# Altium project RK3328.PrjPcb (part 3 of 3)

## Sheet CPU_SDIO_UART_I2C_I2C.SchDoc
size A3; SheetNumber: 10; SheetTotal: 21
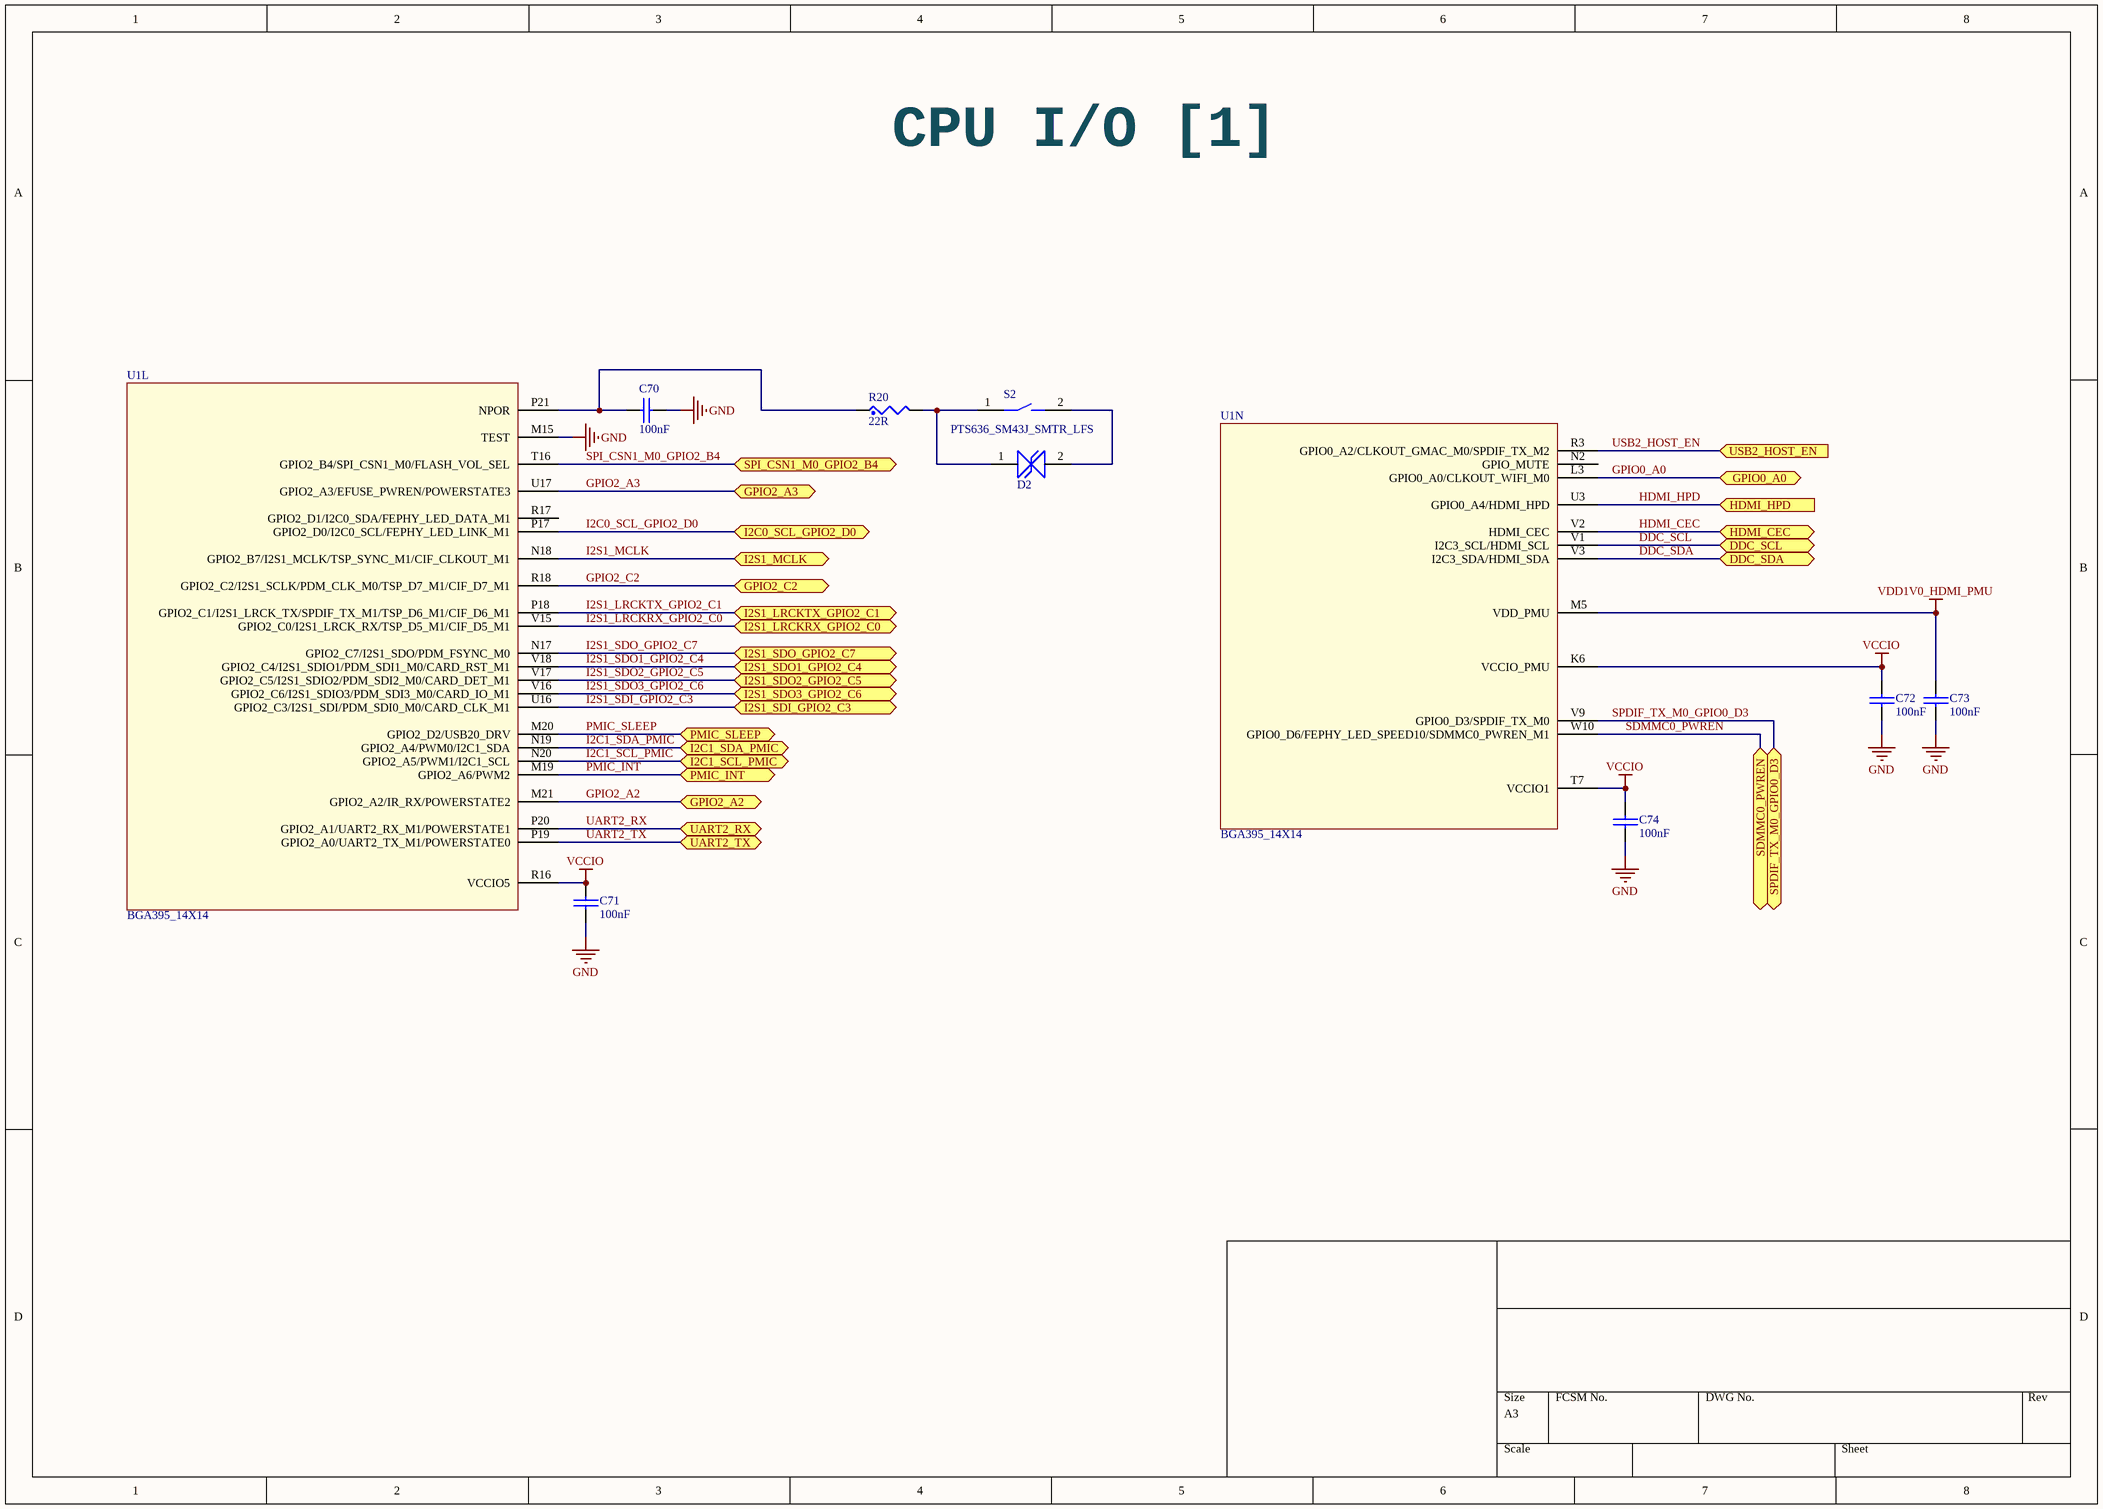
[diagram p18: CPU_SDIO_UART_I2C_I2C.SchDoc]

### Parts
C70  100nF  [0402_CC - C]
C71  100nF  [0402_CC - C]
C72  100nF  [0402_CC - C]
C73  100nF  [0402_CC - C]
C74  100nF  [0402_CC - C]
D2  TVS  [SODFL100X45-2N]  (value not drawn)
R20  22R  [0402_CR]
S2  PTS636_SM43J_SMTR_LFS  [PTS636_3.5_6_4.3]
U1  BGA395_14X14  [BGA395C65P21X21_1750X1750X117]  (parts L,N of 17)

### Ports
DDC_SCL (bidir), DDC_SDA (bidir), GPIO0_A0 (bidir), GPIO2_A2 (bidir), GPIO2_A3 (bidir), GPIO2_C2 (bidir), HDMI_CEC (bidir), HDMI_HPD (in), I2C0_SCL_GPIO2_D0 (bidir), I2C1_SCL_PMIC (bidir), I2C1_SDA_PMIC (bidir), I2S1_LRCKRX_GPIO2_C0 (bidir), I2S1_LRCKTX_GPIO2_C1 (bidir), I2S1_MCLK (bidir), I2S1_SDI_GPIO2_C3 (bidir), I2S1_SDO1_GPIO2_C4 (bidir), I2S1_SDO2_GPIO2_C5 (bidir), I2S1_SDO3_GPIO2_C6 (bidir), I2S1_SDO_GPIO2_C7 (bidir), PMIC_INT (bidir), PMIC_SLEEP (bidir), SDMMC0_PWREN (bidir), SPDIF_TX_M0_GPIO0_D3 (bidir), SPI_CSN1_M0_GPIO2_B4 (bidir), UART2_RX (bidir), UART2_TX (bidir), USB2_HOST_EN (in)

### Nets
GND: C70.2 C71.1 C72.1 C73.1 C74.1 U1.M15(TEST)
VCCIO: C71.2 C72.2 C74.2 U1.K6(VCCIO_PMU) U1.R16(VCCIO5) U1.T7(VCCIO1)
VDD1V0_HDMI_PMU: C73.2 U1.M5(VDD_PMU)
DDC_SCL: U1.V1(I2C3_SCL/HDMI_SCL) ; port DDC_SCL
DDC_SDA: U1.V3(I2C3_SDA/HDMI_SDA) ; port DDC_SDA
GPIO0_A0: U1.L3(GPIO0_A0/CLKOUT_WIFI_M0) ; port GPIO0_A0
GPIO2_A2: U1.M21(GPIO2_A2/IR_RX/POWERSTATE2) ; port GPIO2_A2
GPIO2_A3: U1.U17(GPIO2_A3/EFUSE_PWREN/POWERSTATE3) ; port GPIO2_A3
GPIO2_C2: U1.R18(GPIO2_C2/I2S1_SCLK/PDM_CLK_M0/TSP_D7_M1/CIF_D7_M1) ; port GPIO2_C2
HDMI_CEC: U1.V2(HDMI_CEC) ; port HDMI_CEC
HDMI_HPD: U1.U3(GPIO0_A4/HDMI_HPD) ; port HDMI_HPD
I2C0_SCL_GPIO2_D0: U1.P17(GPIO2_D0/I2C0_SCL/FEPHY_LED_LINK_M1) ; port I2C0_SCL_GPIO2_D0
I2C1_SCL_PMIC: U1.N20(GPIO2_A5/PWM1/I2C1_SCL) ; port I2C1_SCL_PMIC
I2C1_SDA_PMIC: U1.N19(GPIO2_A4/PWM0/I2C1_SDA) ; port I2C1_SDA_PMIC
I2S1_LRCKRX_GPIO2_C0: U1.V15(GPIO2_C0/I2S1_LRCK_RX/TSP_D5_M1/CIF_D5_M1) ; port I2S1_LRCKRX_GPIO2_C0
I2S1_LRCKTX_GPIO2_C1: U1.P18(GPIO2_C1/I2S1_LRCK_TX/SPDIF_TX_M1/TSP_D6_M1/CIF_D6_M1) ; port I2S1_LRCKTX_GPIO2_C1
I2S1_MCLK: U1.N18(GPIO2_B7/I2S1_MCLK/TSP_SYNC_M1/CIF_CLKOUT_M1) ; port I2S1_MCLK
I2S1_SDI_GPIO2_C3: U1.U16(GPIO2_C3/I2S1_SDI/PDM_SDI0_M0/CARD_CLK_M1) ; port I2S1_SDI_GPIO2_C3
I2S1_SDO1_GPIO2_C4: U1.V18(GPIO2_C4/I2S1_SDIO1/PDM_SDI1_M0/CARD_RST_M1) ; port I2S1_SDO1_GPIO2_C4
I2S1_SDO2_GPIO2_C5: U1.V17(GPIO2_C5/I2S1_SDIO2/PDM_SDI2_M0/CARD_DET_M1) ; port I2S1_SDO2_GPIO2_C5
I2S1_SDO3_GPIO2_C6: U1.V16(GPIO2_C6/I2S1_SDIO3/PDM_SDI3_M0/CARD_IO_M1) ; port I2S1_SDO3_GPIO2_C6
I2S1_SDO_GPIO2_C7: U1.N17(GPIO2_C7/I2S1_SDO/PDM_FSYNC_M0) ; port I2S1_SDO_GPIO2_C7
PMIC_INT: U1.M19(GPIO2_A6/PWM2) ; port PMIC_INT
PMIC_SLEEP: U1.M20(GPIO2_D2/USB20_DRV) ; port PMIC_SLEEP
SDMMC0_PWREN: U1.W10(GPIO0_D6/FEPHY_LED_SPEED10/SDMMC0_PWREN_M1) ; port SDMMC0_PWREN
SPDIF_TX_M0_GPIO0_D3: U1.V9(GPIO0_D3/SPDIF_TX_M0) ; port SPDIF_TX_M0_GPIO0_D3
SPI_CSN1_M0_GPIO2_B4: U1.T16(GPIO2_B4/SPI_CSN1_M0/FLASH_VOL_SEL) ; port SPI_CSN1_M0_GPIO2_B4
UART2_RX: U1.P20(GPIO2_A1/UART2_RX_M1/POWERSTATE1) ; port UART2_RX
UART2_TX: U1.P19(GPIO2_A0/UART2_TX_M1/POWERSTATE0) ; port UART2_TX
USB2_HOST_EN: U1.R3(GPIO0_A2/CLKOUT_GMAC_M0/SPDIF_TX_M2) ; port USB2_HOST_EN
NetC70_1: C70.1 R20.1 U1.P21(NPOR)
NetD2_1: D2.1 R20.2 S2.1
NetD2_2: D2.2 S2.2

Not connected (* = marked no-connect by the designer): U1 N2(GPIO_MUTE) R17(GPIO2_D1/I2C0_SDA/FEPHY_LED_DATA_M1)

### Notes on the sheet
- CPU I/O [1]

### Library data of the parts
C70-C74 = CAP_NP: CLASS: DISCRETE
D2 = ESD5451N: AZ5825-01F, Bi-directional TVS, Working Voltage = 5V, Transient protection IEC61000-4-2 : +-30KV,  By AAR; Mfr_Part_No: ESD5451N-2/TR; ComponentLink1Description: Supplier; ComponentLink1URL: https://lcsc.com/product-detail/TVS_Will-Semicon-ESD5451N-2-TR_C239604.html; LCSC Part #: C239604; Package/Case: =Footprint
R20 = RES: CLASS: DISCRETE
S2 = PTS636: Tactile Switches Tact 50mA 12VDC, 6.0x3.5, 4.3mm H, 180gf, J leads, No ground pin, Black Actuator; Mfr_Part_No: PTS636 SM43J SMTR LFS; Mouser No: 611-PTS636SM43JSMTRL
U1 = RK3328: By AAR

## Sheet CPU_AV.SchDoc
size A3; SheetNumber: 21; SheetTotal: 21
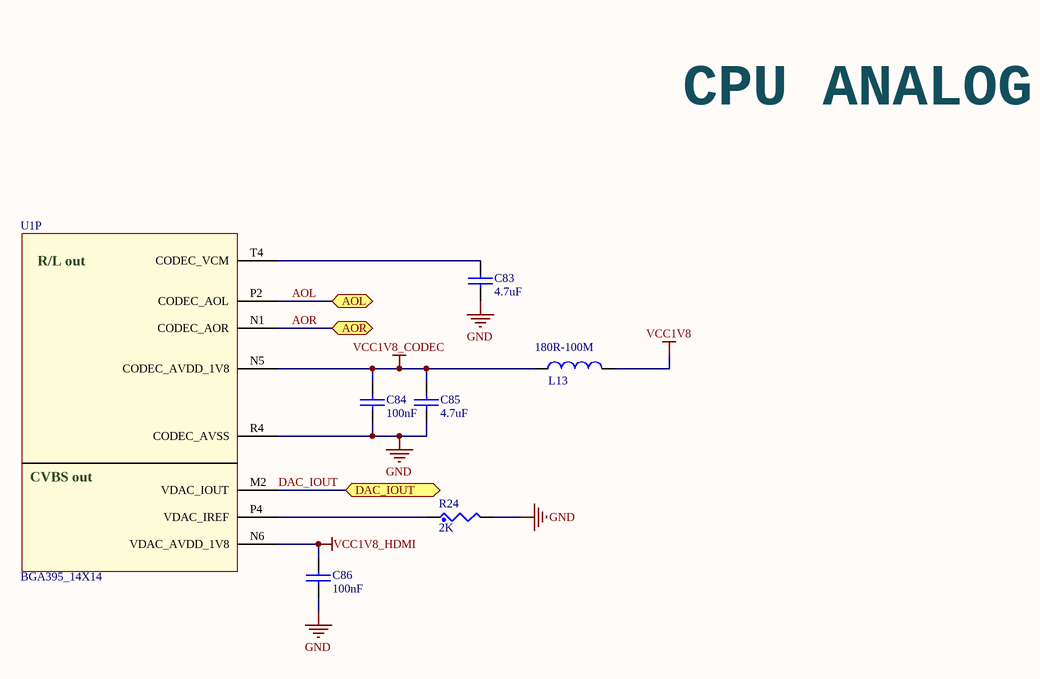
[diagram p19: CPU_AV.SchDoc]

### Parts
C83  4.7uF  [0402_CC - C]
C84  100nF  [0402_CC - C]
C85  4.7uF  [0402_CC - C]
C86  100nF  [0402_CC - C]
L13  180R-100M  [0603_C_Inductor]
R24  2K  [0402_CR]
U1  BGA395_14X14  [BGA395C65P21X21_1750X1750X117]  (part P of 17)

### Ports
AOL (bidir), AOR (bidir), DAC_IOUT (bidir)

### Nets
GND: C83.2 C84.2 C85.2 C86.2 R24.2 U1.R4(CODEC_AVSS)
VCC1V8: L13.2
VCC1V8_CODEC: C84.1 C85.1 L13.1 U1.N5(CODEC_AVDD_1V8)
VCC1V8_HDMI: C86.1 U1.N6(VDAC_AVDD_1V8)
AOL: U1.P2(CODEC_AOL) ; port AOL
AOR: U1.N1(CODEC_AOR) ; port AOR
DAC_IOUT: U1.M2(VDAC_IOUT) ; port DAC_IOUT
NetC83_1: C83.1 U1.T4(CODEC_VCM)
NetR24_1: R24.1 U1.P4(VDAC_IREF)

### Notes on the sheet
- CPU ANALOG
- (in symbol RK3328, part P) R/L out; CVBS out

### Library data of the parts
C83-C86 = CAP_NP: CLASS: DISCRETE
L13 = INDCHIP: Fixed Inductors  TDK, By AAR
R24 = RES: CLASS: DISCRETE
U1 = RK3328: By AAR

## Sheet Power_In_Protection.SchDoc
size A3; SheetNumber: 2; SheetTotal: 21
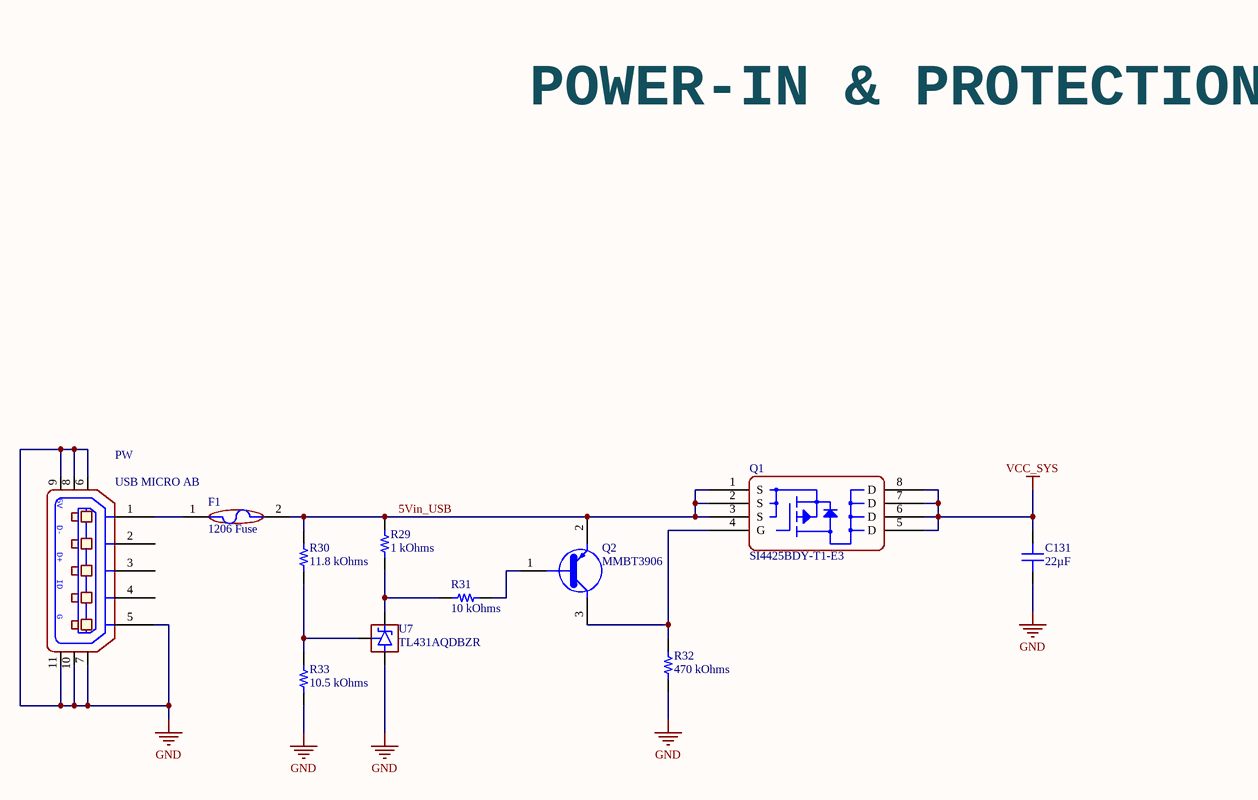
[diagram p20: Power_In_Protection.SchDoc]

### Parts
C131  22µF  [CAP 0603_1608]
F1  1206 Fuse  [FUSE_1206_3216_0.6MM]
PW  USB MICRO AB  [USB_MICRO_AB]
Q1  SI4425BDY-T1-E3  [SO-8]
Q2  MMBT3906  [SOT23_3_95P240X10-3N]
R29  1 kOhms  [RES 1206_3216]
R30  11.8 kOhms  [RES 0402_1005]
R31  10 kOhms  [RES 0402_1005]
R32  470 kOhms  [RES 0402_1005]
R33  10.5 kOhms  [RES 0402_1005]
U7  TL431AQDBZR  [SOT23-3]

### Nets
GND: C131.1 PW.5(P5) PW.6 PW.7 PW.8 PW.9 PW.10 PW.11 R32.1 R33.1 U7.3(ANODE)
VCC_SYS: C131.2 Q1.5(D) Q1.6(D) Q1.7(D) Q1.8(D)
5Vin_USB: F1.2 Q1.1(S) Q1.2(S) Q1.3(S) Q2.2 R29.2 R30.2
NetF1_1: F1.1 PW.1(P1)
NetQ1_4: Q1.4(G) Q2.3 R32.2
NetQ2_1: Q2.1 R31.2
NetR29_1: R29.1 R31.1 U7.1(CATHODE)
NetR30_1: R30.1 R33.2 U7.2(REF)

Not connected (* = marked no-connect by the designer): PW 2(P2) 3(P3) 4(P4)

### Notes on the sheet
- POWER-IN & PROTECTION
- (in symbol 0475890001) 5V; D-; D+; ID; G

### Library data of the parts
C131 = LMK107BBJ226MA-T: CAP CER 22UF 10V X5R 0603; Manufacturer: Taiyo Yuden; Tolerance: ±20%; Part Number: LMK107BBJ226MA-T; Value: 22µF; Applications: SMPS Filtering; Capacitance: 22µF; ComponentLink1Description: Datasheet; ComponentLink1URL: https://ds.yuden.co.jp/TYCOMPAS/ut/detail?pn=LMK107BBJ226MA-T &u=M; ComponentLink2Description: DigiKey Link; ComponentLink2URL: http://digikey.com/product-detail/en/taiyo-yuden/LMK107BBJ226MA-T/587-4913-1-ND/6563756; Device Package: 0603 (1608 Metric); LastUpdated: 9/2/2020 1:03:35 AM; Lifecycle Status: Active; Minimum Order: 1; Mounting Type: Surface Mount, MLCC; Operating Temperature: -55°C ~ 85°C; Package / Case: 0603 (1608 Metric); Packaging: TapeAndReel; PartId: 2677; Part Status: Active; Price: 0.11; Series: M; Size / Dimension: 0.063" L x 0.031" W (1.60mm x 0.80mm); Supplier 1: DigiKey; Supplier Part Number 1: 587-4913-1-ND; Temperature Coefficient: X5R; Thickness (Max): 0.039" (1.00mm); Voltage - Rated: 10V
F1 = Mounted_Fuse: FUSE BRD MNT 4A 32VAC 63VDC 1206; Mfr_Part_No: 3413.0222.22; Mfr: Schurter Inc.
PW = 0475890001: CONN RCPT MICRO USB AB R/A SMD; Mfr: Molex Inc; Connector Type: USB - micro AB; Number of Contacts: 5; Gender: Receptacle; Supplier 1: Digi-Key; Mfr_Part_No: 0475890001; RoHS: RoHS Compliant; Category: Connectors, Interconnects; Stock 1: 12754; Pricing 1: 1=0.81, 10=0.764, 25=0.6872, 50=0.6108, 100=0.5854, 250=0.53452, 500=0.50908 (USD); Packaging: Cut Tape (CT); Specifications: -; Mounting Type: Surface Mount, Right Angle, Horizontal; Features: Board Guide, Shielded; Ingress Protection: -; ComponentLink1URL: http://www.molex.com/pdm_docs/sd/475890001_sd.pdf; ComponentLink1Description: http://www.molex.com/pdm_docs/sd/475890001_sd.pdf; Supplier Part Number 1: WM17143CT-ND
Q1 = SI4425BDY-T1-E3: MOSFET P-CH 30V 8.8A 8-SOIC; Mfr: Vishay Siliconix; FET Type: MOSFET P-Channel, Metal Oxide; FET Feature: Logic Level Gate; Current - Continuous Drain (Id) @ 25°C: 8.8A (Ta); Rds On (Max) @ Id, Vgs: 12 mOhm @ 11.4A, 10V; Vgs(th) (Max) @ Id: 3V @ 250µA; Gate Charge (Qg) @ Vgs: 100nC @ 10V; Power - Max: 1.5W; .Checked PCB: MM; Supplier 1: Digi-Key; Mfr_Part_No: SI4425BDY-T1-E3; RoHS: RoHS Compliant; Category: Discrete Semiconductor Products; Stock 1: 26582; Pricing 1: 1=1, 10=0.88, 25=0.7948, 100=0.6955, 250=0.60996, 500=0.54096, 1000=0.4278 (USD); Packaging: Cut Tape (CT); Drain to Source Voltage (Vdss): 30V; Input Capacitance (Ciss) @ Vds: -; Mounting Type: Surface Mount; Package / Case: 8-SOIC (0.154", 3.90mm Width); Supplier Device Package: 8-SO; ComponentLink1URL: http://www.vishay.com/docs/72000/72000.pdf; ComponentLink1Description: http://www.vishay.com/docs/72000/72000.pdf; Supplier Part Number 1: SI4425BDY-T1-E3CT-ND; .Checked SCH: MM; .Creator: MM
Q2 = MMBT3906: Bipolar (BJT) Transistor PNP 40V 200mA 250MHz 250mW Surface Mount TO-236AB; Mfr_Part_No: MMBT3906,215; Mfr: Nexperia USA; DigiKey_Part_Number: 1727-4045-1-ND; Package: SOT23-3 Nexperia USA Inc.; Value: *
R29 = RNCP1206FTD1K00: RES 1K OHM 1% 1/2W 1206; Manufacturer: Stackpole Electronics Inc; Power (Watts): 0.5W, 1/2W; Temperature Coefficient: ±100ppm/°C; Part Number: RNCP1206FTD1K00; ComponentLink1Description: Datasheet; ComponentLink1URL: https://www.seielect.com/catalog/sei-rncp.pdf; ComponentLink2Description: DigiKey Link; ComponentLink2URL: https://www.digikey.com/en/products/detail/stackpole-electronics-inc/RNCP1206FTD1K00/2240337; Composition: Thin Film; Device Package: 1206 (3216 Metric); Features: Anti-Sulfur, Moisture Resistant; Height - Seated (Max): 0.024" (0.60mm); LastUpdated: 2/26/2022 8:52:38 AM; Lifecycle Status: Active; Minimum Order: 1; Number of Terminations: 2; Operating Temperature: -55°C ~ 155°C; Package / Case: 1206 (3216 Metric); Packaging: TapeAndReel; PartId: 26970; Part Status: Active; Price: 0.01; Resistance: 1 kOhms; Series: RNCP; Size / Dimension: 0.122" L x 0.059" W (3.10mm x 1.50mm); Supplier 1: DigiKey; Supplier Part Number 1: RNCP1206FTD1K00CT-ND; Supplier Device Package: 1206; Tolerance: ±1%; Value: 1 kOhms
R30 = RC0402FR-0711K8L: RES 11.8K OHM 1% 1/16W 0402; Manufacturer: Yageo; Power (Watts): 0.063W, 1/16W; Temperature Coefficient: ±100ppm/°C; Part Number: RC0402FR-0711K8L; Value: 11.8 kOhms; ComponentLink1Description: Datasheet; ComponentLink1URL: https://www.yageo.com/upload/media/product/productsearch/datasheet/rchip/PYu-RC_Group_51_RoHS_L_10.pdf; ComponentLink2Description: DigiKey Link; ComponentLink2URL: https://www.digikey.com/en/products/detail/yageo/RC0402FR-0711K8L/5280818; Composition: Thick Film; Device Package: 0402 (1005 Metric); Features: Moisture Resistant; Height - Seated (Max): 0.016" (0.40mm); LastUpdated: 2/26/2022 8:42:17 AM; Lifecycle Status: Active; Minimum Order: 1; Number of Terminations: 2; Operating Temperature: -55°C ~ 155°C; Package / Case: 0402 (1005 Metric); Packaging: CutTape; PartId: 2614; Part Status: Active; Price: 0.01; Resistance: 11.8 kOhms; Series: RC_L; Size / Dimension: 0.039" L x 0.020" W (1.00mm x 0.50mm); Supplier 1: DigiKey; Supplier Part Number 1: YAG2958CT-ND; Supplier Device Package: 0402; Tolerance: ±1%
R31 = RP73PF1E10KBTD: RES 10K OHM 0.1% 1/10W 0402; Manufacturer: TE Connectivity Passive Product; Power (Watts): 0.1W, 1/10W; Temperature Coefficient: ±25ppm/°C; Part Number: RP73PF1E10KBTD; Value: 10 kOhms; ComponentLink1Description: Datasheet; ComponentLink1URL: https://www.te.com/commerce/DocumentDelivery/DDEController?Action=srchrtrv&DocNm=1773272&DocType=DS&DocLang=English; ComponentLink2Description: DigiKey Link; ComponentLink2URL: https://www.digikey.com/en/products/detail/te-connectivity-passive-product/RP73PF1E10KBTD/8260957; Composition: Thin Film; Device Package: 0402 (1005 Metric); Height - Seated (Max): 0.014" (0.35mm); LastUpdated: 2/26/2022 8:42:17 AM; Lifecycle Status: Active; Minimum Order: 1; Number of Terminations: 2; Operating Temperature: -55°C ~ 155°C; Package / Case: 0402 (1005 Metric); Packaging: TapeAndReel; PartId: 2434; Part Status: Active; Price: 0.09; Resistance: 10 kOhms; Series: RP73, Holsworthy; Size / Dimension: 0.039" L x 0.020" W (1.00mm x 0.50mm); Supplier 1: DigiKey; Supplier Part Number 1: A127415CT-ND; Supplier Device Package: 0402; Tolerance: ±0.1%
R32 = CRGP0402F470K: RES 470K OHM 1% 1/8W 0402; Manufacturer: TE Connectivity Passive Product; Power (Watts): 0.125W, 1/8W; Temperature Coefficient: ±100ppm/°C; Part Number: CRGP0402F470K; Value: 470 kOhms; ComponentLink1Description: Datasheet; ComponentLink1URL: https://www.te.com/commerce/DocumentDelivery/DDEController?Action=srchrtrv&DocNm=9-1773463-9&DocType=DS&DocLang=English; ComponentLink2Description: DigiKey Link; ComponentLink2URL: https://www.digikey.com/en/products/detail/te-connectivity-passive-product/CRGP0402F470K/8576989; Composition: Thick Film; Device Package: 0402 (1005 Metric); Features: Pulse Withstanding; Height - Seated (Max): 0.016" (0.40mm); LastUpdated: 2/26/2022 8:42:16 AM; Lifecycle Status: Active; Minimum Order: 1; Number of Terminations: 2; Operating Temperature: -55°C ~ 155°C; Package / Case: 0402 (1005 Metric); Packaging: TapeAndReel; PartId: 2840; Part Status: Active; Price: 0.01; Resistance: 470 kOhms; Series: CRGP; Size / Dimension: 0.043" L x 0.020" W (1.10mm x 0.50mm); Supplier 1: DigiKey; Supplier Part Number 1: A130387CT-ND; Supplier Device Package: 0402; Tolerance: ±1%
R33 = RC0402FR-0710K5L: RES 10.5K OHM 1% 1/16W 0402; Manufacturer: Yageo; Power (Watts): 0.063W, 1/16W; Temperature Coefficient: ±100ppm/°C; Part Number: RC0402FR-0710K5L; Value: 10.5 kOhms; ComponentLink1Description: Datasheet; ComponentLink1URL: https://www.yageo.com/upload/media/product/productsearch/datasheet/rchip/PYu-RC_Group_51_RoHS_L_10.pdf; ComponentLink2Description: DigiKey Link; ComponentLink2URL: https://www.digikey.com/en/products/detail/yageo/RC0402FR-0710K5L/5280811; Composition: Thick Film; Device Package: 0402 (1005 Metric); Features: Moisture Resistant; Height - Seated (Max): 0.016" (0.40mm); LastUpdated: 2/26/2022 8:42:16 AM; Lifecycle Status: Active; Minimum Order: 1; Number of Terminations: 2; Operating Temperature: -55°C ~ 155°C; Package / Case: 0402 (1005 Metric); Packaging: CutTape; PartId: 2734; Part Status: Active; Price: 0.01; Resistance: 10.5 kOhms; Series: RC_L; Size / Dimension: 0.039" L x 0.020" W (1.00mm x 0.50mm); Supplier 1: DigiKey; Supplier Part Number 1: YAG2951CT-ND; Supplier Device Package: 0402; Tolerance: ±1%
U7 = TL431AQDBZR: Shunt Voltage Reference IC 36V ±1% SOT-23-3; Mfr: Texas Instruments; Package: SOT-23-3 Texas Instruments; Mfr_Part_No: TL431AQDBZR; Value: *; Availability: Unavailable; Price: None; Mouser No: 595-TL431AQDBZR

## Nets that join several sheets
GND: SYSTEM_PMIC_RK805 (34 pins), CPU_CORE_POWER_GND (167 pins), CPU_DDR (5 pins), DRAM_DDR4 (89 pins), CPU_eMMC_TF (C58.2 C59.2), eMMC_SD (32 pins), OSC_PLL_SARDC_OPTeFUSE (17 pins), CPU_USB2_USB3_PHY (12 pins), USB3 (29 pins), USB2_host_otg (15 pins), CPU_HDMI_PHY (6 pins), HDMI (27 pins), CPU_ETH (C75.1 C81.2 C82.2 R22.2), ETHERNET_PHY (29 pins), ETHERNET (12 pins), GPIO_HEADER (6 pins), CPU_SDIO_UART_I2C_I2C (6 pins), CPU_AV (6 pins), Power_In_Protection (11 pins)
USB2_PH_1V0: CPU_USB2_USB3_PHY (5 pins), CPU_ETH (C82.1 U1.V6)
USB2_PH_1V8: CPU_USB2_USB3_PHY (C61.1 C62.1 L7.1 U1.U5), CPU_ETH (C81.1 U1.U6)
VCC1V8: SYSTEM_PMIC_RK805 (C21.1 U2.3), OSC_PLL_SARDC_OPTeFUSE (7 pins), CPU_USB2_USB3_PHY (C63.1 L7.2), CPU_HDMI_PHY (L11.2), CPU_AV (L13.2)
VCC1V8_HDMI: CPU_HDMI_PHY (C76.1 C77.1 L11.1 U1.P6), CPU_AV (C86.1 U1.N6)
VCC18EMMC: SYSTEM_PMIC_RK805 (C20.1 U2.5), eMMC_SD (R95.2)
VCC_SYS: SYSTEM_PMIC_RK805 (13 pins), DRAM_DDR4 (C93.1 R26.2 U5.1), USB3 (C163.1 C164.1 FB2.1 U15.12), USB2_host_otg (C172.1 FB3.1 U18.5), HDMI (C158.2 U9.1), GPIO_HEADER (J4.39), Power_In_Protection (5 pins)
VCCDDR: SYSTEM_PMIC_RK805 (6 pins), CPU_DDR (18 pins), DRAM_DDR4 (76 pins)
VCCIO: SYSTEM_PMIC_RK805 (13 pins), CPU_eMMC_TF (C59.1 U1.H6 U1.U7), eMMC_SD (9 pins), CPU_USB2_USB3_PHY (6 pins), USB3 (7 pins), HDMI (5 pins), ETHERNET_PHY (FB1.1), GPIO_HEADER (J4.40), CPU_SDIO_UART_I2C_I2C (6 pins)
VCCIO_FLASH: CPU_eMMC_TF (C58.1 U1.T17), eMMC_SD (14 pins)
VDD1V0: SYSTEM_PMIC_RK805 (C24.1 U2.24), OSC_PLL_SARDC_OPTeFUSE (C47.1 L5.2), CPU_USB2_USB3_PHY (C66.1 L8.2), CPU_HDMI_PHY (L12.2)
VDD1V0_HDMI_PMU: CPU_HDMI_PHY (5 pins), CPU_SDIO_UART_I2C_I2C (C73.2 U1.M5)
VDD_3V3_PHY: ETHERNET_PHY (20 pins), ETHERNET (J2.14)
VDDARM: SYSTEM_PMIC_RK805 (5 pins), CPU_CORE_POWER_GND (13 pins)
VDDLOG: SYSTEM_PMIC_RK805 (5 pins), CPU_CORE_POWER_GND (17 pins), CPU_USB2_USB3_PHY (L9.2)
VDDPLL_USB3_1V0: OSC_PLL_SARDC_OPTeFUSE (C45.1 C46.1 L5.1 U1.H7), CPU_USB2_USB3_PHY (C69.1 U1.J7)
VDDPLL_USB3_1V8: OSC_PLL_SARDC_OPTeFUSE (C48.1 C49.1 L6.1 U1.H5), CPU_USB2_USB3_PHY (C68.1 U1.J5)
AOL: GPIO_HEADER (J4.12), CPU_AV (U1.P2)
AOR: GPIO_HEADER (J4.9), CPU_AV (U1.N1)
CON_DET_BUF: CPU_eMMC_TF (U1.F2), USB3 (U17.4)
DAC_IOUT: GPIO_HEADER (J4.2), CPU_AV (U1.M2)
DDC_SCL: HDMI (U9.17), CPU_SDIO_UART_I2C_I2C (U1.V1)
DDC_SDA: HDMI (U9.18), CPU_SDIO_UART_I2C_I2C (U1.V3)
DDR4_A0: CPU_DDR (U1.F19), DRAM_DDR4 (U3.P3 U4.P3)
DDR4_A1: CPU_DDR (U1.G21), DRAM_DDR4 (U3.P7 U4.P7)
DDR4_A2: CPU_DDR (U1.F18), DRAM_DDR4 (U3.R3 U4.R3)
DDR4_A3: CPU_DDR (U1.G20), DRAM_DDR4 (U3.N7 U4.N7)
DDR4_A4: CPU_DDR (U1.H18), DRAM_DDR4 (U3.N3 U4.N3)
DDR4_A5: CPU_DDR (U1.H21), DRAM_DDR4 (U3.P8 U4.P8)
DDR4_A6: CPU_DDR (U1.E20), DRAM_DDR4 (U3.P2 U4.P2)
DDR4_A7: CPU_DDR (U1.H20), DRAM_DDR4 (U3.R8 U4.R8)
DDR4_A8: CPU_DDR (U1.D21), DRAM_DDR4 (U3.R2 U4.R2)
DDR4_A9: CPU_DDR (U1.K18), DRAM_DDR4 (U3.R7 U4.R7)
DDR4_A10: CPU_DDR (U1.G19), DRAM_DDR4 (U3.M3 U4.M3)
DDR4_A11: CPU_DDR (U1.D20), DRAM_DDR4 (U3.T2 U4.T2)
DDR4_A12: CPU_DDR (U1.J18), DRAM_DDR4 (U3.M7 U4.M7)
DDR4_A13: CPU_DDR (U1.K19), DRAM_DDR4 (U3.T8 U4.T8)
DDR4_ACTn: CPU_DDR (U1.C20), DRAM_DDR4 (U3.L3 U4.L3)
DDR4_BA0: CPU_DDR (U1.E21), DRAM_DDR4 (U3.N2 U4.N2)
DDR4_BA1: CPU_DDR (U1.J21), DRAM_DDR4 (U3.N8 U4.N8)
DDR4_BG0: CPU_DDR (U1.C21), DRAM_DDR4 (U3.M2 U4.M2)
DDR4_CASn_A15: CPU_DDR (U1.K20), DRAM_DDR4 (U3.M8 U4.M8)
DDR4_CKE: CPU_DDR (U1.D19), DRAM_DDR4 (U3.K2 U4.K2)
DDR4_CLK_N: CPU_DDR (U1.A20), DRAM_DDR4 (R112.1 U3.K8 U4.K8)
DDR4_CLK_P: CPU_DDR (U1.B20), DRAM_DDR4 (R111.1 U3.K7 U4.K7)
DDR4_CS0n: CPU_DDR (U1.K21), DRAM_DDR4 (U3.L7 U4.L7)
DDR4_D0: CPU_DDR (U1.D7), DRAM_DDR4 (U3.D7)
DDR4_D1: CPU_DDR (U1.A7), DRAM_DDR4 (U3.A3)
DDR4_D2: CPU_DDR (U1.C5), DRAM_DDR4 (U3.C7)
DDR4_D3: CPU_DDR (U1.B2), DRAM_DDR4 (U3.C8)
DDR4_D4: CPU_DDR (U1.B9), DRAM_DDR4 (U3.D3)
DDR4_D5: CPU_DDR (U1.C7), DRAM_DDR4 (U3.C2)
DDR4_D6: CPU_DDR (U1.B7), DRAM_DDR4 (U3.C3)
DDR4_D7: CPU_DDR (U1.A2), DRAM_DDR4 (U3.B8)
DDR4_D8: CPU_DDR (U1.C4), DRAM_DDR4 (U3.F7)
DDR4_D9: CPU_DDR (U1.C8), DRAM_DDR4 (U3.G2)
DDR4_D10: CPU_DDR (U1.B1), DRAM_DDR4 (U3.H7)
DDR4_D11: CPU_DDR (U1.B10), DRAM_DDR4 (U3.J3)
DDR4_D12: CPU_DDR (U1.D4), DRAM_DDR4 (U3.J7)
DDR4_D13: CPU_DDR (U1.C10), DRAM_DDR4 (U3.H2)
DDR4_D14: CPU_DDR (U1.C2), DRAM_DDR4 (U3.H8)
DDR4_D15: CPU_DDR (U1.D9), DRAM_DDR4 (U3.H3)
DDR4_D16: CPU_DDR (U1.D16), DRAM_DDR4 (U4.C3)
DDR4_D17: CPU_DDR (U1.C15), DRAM_DDR4 (U4.A3)
DDR4_D18: CPU_DDR (U1.C16), DRAM_DDR4 (U4.C2)
DDR4_D19: CPU_DDR (U1.B12), DRAM_DDR4 (U4.B8)
DDR4_D20: CPU_DDR (U1.B11), DRAM_DDR4 (U4.C7)
DDR4_D21: CPU_DDR (U1.A10), DRAM_DDR4 (U4.D7)
DDR4_D22: CPU_DDR (U1.B17), DRAM_DDR4 (U4.D3)
DDR4_D23: CPU_DDR (U1.A11), DRAM_DDR4 (U4.C8)
DDR4_D24: CPU_DDR (U1.C12), DRAM_DDR4 (U4.H8)
DDR4_D25: CPU_DDR (U1.D13), DRAM_DDR4 (U4.H7)
DDR4_D26: CPU_DDR (U1.B19), DRAM_DDR4 (U4.J3)
DDR4_D27: CPU_DDR (U1.B18), DRAM_DDR4 (U4.H2)
DDR4_D28: CPU_DDR (U1.D12), DRAM_DDR4 (U4.J7)
DDR4_D29: CPU_DDR (U1.C13), DRAM_DDR4 (U4.F7)
DDR4_D30: CPU_DDR (U1.A18), DRAM_DDR4 (U4.H3)
DDR4_D31: CPU_DDR (U1.A17), DRAM_DDR4 (U4.G2)
DDR4_DM0: CPU_DDR (U1.B6), DRAM_DDR4 (U3.E2)
DDR4_DM1: CPU_DDR (U1.D5), DRAM_DDR4 (U3.E7)
DDR4_DM2: CPU_DDR (U1.D15), DRAM_DDR4 (U4.E2)
DDR4_DM3: CPU_DDR (U1.D10), DRAM_DDR4 (U4.E7)
DDR4_DQS0_N: CPU_DDR (U1.A3), DRAM_DDR4 (U3.A7)
DDR4_DQS0_P: CPU_DDR (U1.B3), DRAM_DDR4 (U3.B7)
DDR4_DQS1_N: CPU_DDR (U1.A5), DRAM_DDR4 (U3.F3)
DDR4_DQS1_P: CPU_DDR (U1.B5), DRAM_DDR4 (U3.G3)
DDR4_DQS2_N: CPU_DDR (U1.A13), DRAM_DDR4 (U4.A7)
DDR4_DQS2_P: CPU_DDR (U1.B13), DRAM_DDR4 (U4.B7)
DDR4_DQS3_N: CPU_DDR (U1.A15), DRAM_DDR4 (U4.F3)
DDR4_DQS3_P: CPU_DDR (U1.B15), DRAM_DDR4 (U4.G3)
DDR4_ODT0: CPU_DDR (U1.J19), DRAM_DDR4 (U3.K3 U4.K3)
DDR4_RASn_A16: CPU_DDR (U1.L20), DRAM_DDR4 (U3.L8 U4.L8)
DDR4_RSTn: CPU_DDR (U1.B21), DRAM_DDR4 (U3.P1 U4.P1)
DDR4_WEn_A14: CPU_DDR (U1.E18), DRAM_DDR4 (U3.L2 U4.L2)
eMMC_CLKO: CPU_eMMC_TF (U1.R21), eMMC_SD (R97.1)
eMMC_CMD: CPU_eMMC_TF (U1.R20), eMMC_SD (R96.2 U10.M5)
eMMC_D0: CPU_eMMC_TF (U1.U19), eMMC_SD (R94.2 U10.A3)
eMMC_D1: CPU_eMMC_TF (U1.U20), eMMC_SD (U10.A4)
eMMC_D2: CPU_eMMC_TF (U1.U21), eMMC_SD (U10.A5)
eMMC_D3: CPU_eMMC_TF (U1.V19), eMMC_SD (U10.B2)
eMMC_D4: CPU_eMMC_TF (U1.U18), eMMC_SD (U10.B3)
eMMC_D5: CPU_eMMC_TF (U1.W21), eMMC_SD (U10.B4)
eMMC_D6: CPU_eMMC_TF (U1.T18), eMMC_SD (U10.B5)
eMMC_D7: CPU_eMMC_TF (U1.T19), eMMC_SD (U10.B6)
eMMC_RST: CPU_eMMC_TF (U1.R19), eMMC_SD (R98.2 U10.K5)
EPHY_RESET: CPU_ETH (U1.W20), ETHERNET_PHY (R57.2)
GMAC_CLK: CPU_ETH (U1.W15), ETHERNET_PHY (R34.2 R46.1)
GMAC_MDC: CPU_ETH (U1.W17), ETHERNET_PHY (U6.30)
GMAC_MDIO: CPU_ETH (U1.Y21), ETHERNET_PHY (R72.1 U6.31)
GMAC_RXCLK: CPU_ETH (U1.Y20), ETHERNET_PHY (R44.1)
GMAC_RXD0: CPU_ETH (U1.V13), ETHERNET_PHY (R40.1 R70.1)
GMAC_RXD1: CPU_ETH (U1.W14), ETHERNET_PHY (R41.1 R68.1)
GMAC_RXD2: CPU_ETH (U1.W18), ETHERNET_PHY (R42.1 R62.1)
GMAC_RXD3: CPU_ETH (U1.W19), ETHERNET_PHY (R43.1 R63.1)
GMAC_RXDV: CPU_ETH (U1.W16), ETHERNET_PHY (R45.1)
GMAC_TXCLK: CPU_ETH (U1.AA20), ETHERNET_PHY (R56.2)
GMAC_TXD0: CPU_ETH (U1.AA15), ETHERNET_PHY (R51.2)
GMAC_TXD1: CPU_ETH (U1.Y15), ETHERNET_PHY (R52.2)
GMAC_TXD2: CPU_ETH (U1.Y19), ETHERNET_PHY (R53.2)
GMAC_TXD3: CPU_ETH (U1.AA19), ETHERNET_PHY (R54.2)
GMAC_TXEN: CPU_ETH (U1.Y17), ETHERNET_PHY (R55.2)
GPIO0_A0: GPIO_HEADER (J4.1), CPU_SDIO_UART_I2C_I2C (U1.L3)
GPIO1_D0: CPU_ETH (U1.AA17), GPIO_HEADER (J4.18)
GPIO1_D2: CPU_ETH (U1.V12), GPIO_HEADER (J4.13)
GPIO1_D4: CPU_ETH (U1.V14), GPIO_HEADER (J4.16)
GPIO2_A2: GPIO_HEADER (J4.31), CPU_SDIO_UART_I2C_I2C (U1.M21)
GPIO2_A3: GPIO_HEADER (J4.22), CPU_SDIO_UART_I2C_I2C (U1.U17)
GPIO2_C2: GPIO_HEADER (J4.33), CPU_SDIO_UART_I2C_I2C (U1.R18)
GPIO3_A0: CPU_eMMC_TF (U1.E3), GPIO_HEADER (J4.7)
GPIO3_A1: CPU_eMMC_TF (U1.D2), GPIO_HEADER (J4.4)
GPIO3_A2: CPU_eMMC_TF (U1.E1), GPIO_HEADER (J4.5)
GPIO3_A4: CPU_eMMC_TF (U1.E2), GPIO_HEADER (J4.8)
GPIO3_A5: CPU_eMMC_TF (U1.D1), GPIO_HEADER (J4.6)
GPIO3_A7: CPU_eMMC_TF (U1.F1), GPIO_HEADER (J4.3)
GPIO3_B0: CPU_eMMC_TF (U1.F3), GPIO_HEADER (J4.10)
HDMI_CEC: HDMI (U9.16), CPU_SDIO_UART_I2C_I2C (U1.V2)
HDMI_CLK_N: CPU_HDMI_PHY (U1.W2), HDMI (J1.12 U9.15 U9.24)
HDMI_CLK_P: CPU_HDMI_PHY (U1.Y1), HDMI (J1.10 U9.13 U9.26)
HDMI_D0_N: CPU_HDMI_PHY (U1.Y2), HDMI (J1.9 U9.12 U9.27)
HDMI_D0_P: CPU_HDMI_PHY (U1.AA2), HDMI (J1.7 U9.10 U9.29)
HDMI_D1_N: CPU_HDMI_PHY (U1.Y3), HDMI (J1.6 U9.9 U9.30)
HDMI_D1_P: CPU_HDMI_PHY (U1.Y4), HDMI (J1.4 U9.7 U9.32)
HDMI_D2_N: CPU_HDMI_PHY (U1.AA4), HDMI (J1.3 U9.6 U9.33)
HDMI_D2_P: CPU_HDMI_PHY (U1.Y5), HDMI (J1.1 U9.4 U9.35)
HDMI_HPD: HDMI (R80.1 U11.4), CPU_SDIO_UART_I2C_I2C (U1.U3)
I2C0_SCL_GPIO2_D0: GPIO_HEADER (J4.26), CPU_SDIO_UART_I2C_I2C (U1.P17)
I2C1_SCL_PMIC: SYSTEM_PMIC_RK805 (R9.1 U2.7), CPU_SDIO_UART_I2C_I2C (U1.N20)
I2C1_SDA_PMIC: SYSTEM_PMIC_RK805 (R10.1 U2.8), CPU_SDIO_UART_I2C_I2C (U1.N19)
I2S1_LRCKRX_GPIO2_C0: GPIO_HEADER (J4.15), CPU_SDIO_UART_I2C_I2C (U1.V15)
I2S1_LRCKTX_GPIO2_C1: GPIO_HEADER (J4.24), CPU_SDIO_UART_I2C_I2C (U1.P18)
I2S1_MCLK: GPIO_HEADER (J4.21), CPU_SDIO_UART_I2C_I2C (U1.N18)
I2S1_SDI_GPIO2_C3: GPIO_HEADER (J4.30), CPU_SDIO_UART_I2C_I2C (U1.U16)
I2S1_SDO1_GPIO2_C4: GPIO_HEADER (J4.34), CPU_SDIO_UART_I2C_I2C (U1.V18)
I2S1_SDO2_GPIO2_C5: GPIO_HEADER (J4.17), CPU_SDIO_UART_I2C_I2C (U1.V17)
I2S1_SDO3_GPIO2_C6: GPIO_HEADER (J4.20), CPU_SDIO_UART_I2C_I2C (U1.V16)
I2S1_SDO_GPIO2_C7: GPIO_HEADER (J4.23), CPU_SDIO_UART_I2C_I2C (U1.N17)
LED0_AD0: ETHERNET_PHY (R65.1 U6.34), ETHERNET (R58.2)
LED1_AD1: ETHERNET_PHY (R67.1 U6.35), ETHERNET (J2.16)
MDI0_N: ETHERNET_PHY (U6.2), ETHERNET (D3.4 D3.7 J2.10)
MDI0_P: ETHERNET_PHY (U6.1), ETHERNET (D3.5 D3.6 J2.11)
MDI1_N: ETHERNET_PHY (U6.5), ETHERNET (D3.1 D3.10 J2.5)
MDI1_P: ETHERNET_PHY (U6.4), ETHERNET (D3.2 D3.9 J2.4)
MDI2_N: ETHERNET_PHY (U6.8), ETHERNET (D4.4 D4.7 J2.2)
MDI2_P: ETHERNET_PHY (U6.7), ETHERNET (D4.5 D4.6 J2.3)
MDI3_N: ETHERNET_PHY (U6.11), ETHERNET (D4.1 D4.10 J2.9)
MDI3_P: ETHERNET_PHY (U6.10), ETHERNET (D4.2 D4.9 J2.8)
OTG2_D_N: CPU_USB2_USB3_PHY (U1.Y6), USB2_host_otg (L16.2)
OTG2_D_P: CPU_USB2_USB3_PHY (U1.AA6), USB2_host_otg (L16.1)
PMIC_INT: SYSTEM_PMIC_RK805 (U2.6), CPU_SDIO_UART_I2C_I2C (U1.M19)
PMIC_SLEEP: SYSTEM_PMIC_RK805 (U2.2), CPU_SDIO_UART_I2C_I2C (U1.M20)
SDMMC0_CLK: CPU_eMMC_TF (U1.W12), eMMC_SD (R103.2)
SDMMC0_CMD: CPU_eMMC_TF (U1.Y13), eMMC_SD (R102.2)
SDMMC0_D0: CPU_eMMC_TF (U1.U10), eMMC_SD (R104.2)
SDMMC0_D1: CPU_eMMC_TF (U1.W11), eMMC_SD (R105.2)
SDMMC0_D2_JTAG_TCK: CPU_eMMC_TF (U1.W13), eMMC_SD (R106.2)
SDMMC0_D3_JTAG_TMS: CPU_eMMC_TF (U1.AA13), eMMC_SD (R107.2)
SDMMC0_DET: CPU_eMMC_TF (U1.V10), eMMC_SD (R108.2)
SDMMC0_PWREN: eMMC_SD (R100.1 R101.2), CPU_SDIO_UART_I2C_I2C (U1.W10)
SPDIF_TX_M0_GPIO0_D3: GPIO_HEADER (J4.32), CPU_SDIO_UART_I2C_I2C (U1.V9)
SPI_CSN1_M0_GPIO2_B4: GPIO_HEADER (J4.29), CPU_SDIO_UART_I2C_I2C (U1.T16)
UART2_RX: GPIO_HEADER (J4.25), CPU_SDIO_UART_I2C_I2C (U1.P20)
UART2_TX: GPIO_HEADER (J4.19), CPU_SDIO_UART_I2C_I2C (U1.P19)
USB2_HOST_EN: USB2_host_otg (R92.1 U18.4), CPU_SDIO_UART_I2C_I2C (U1.R3)
USB2_HS_D_N: CPU_USB2_USB3_PHY (U1.Y7), USB2_host_otg (L15.2)
USB2_HS_D_P: CPU_USB2_USB3_PHY (U1.AA7), USB2_host_otg (L15.1)
USB3_D_N: CPU_USB2_USB3_PHY (U1.K2), USB3 (L10.3)
USB3_D_P: CPU_USB2_USB3_PHY (U1.K1), USB3 (L10.4)
USB3_RX_N: CPU_USB2_USB3_PHY (U1.J3), USB3 (U12.8)
USB3_RX_P: CPU_USB2_USB3_PHY (U1.J2), USB3 (U12.7)
USB3_TX_N: CPU_USB2_USB3_PHY (U1.H2), USB3 (U12.4)
USB3_TX_P: CPU_USB2_USB3_PHY (U1.H3), USB3 (U12.3)